# Altium schematic sheet 毕设.SchDoc
size A4
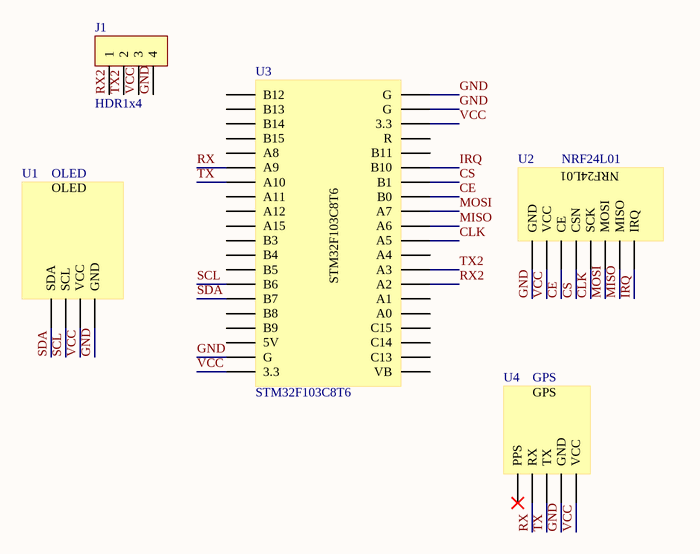
[diagram p0: 毕设.SchDoc]

## Parts
J1  HDR1x4  [PIN-4-2.54-1.0]
U1  OLED  [OLED]
U2  NRF24L01  [NRF24L01]
U3  STM32F103C8T6  [STM32F103C8T6]
U4  GPS  [GPS]

## Nets
CE: U2.3(CE) U3.13(B0)
CLK: U2.5(SCK) U3.10(A5)
CS: U2.4(CSN) U3.14(B1)
GND: J1.4 U1.4(GND) U2.1(GND) U3.19(G) U3.20(G) U3.22(G) U4.4(GND)
IRQ: U2.8(IRQ) U3.15(B10)
MISO: U2.7(MISO) U3.11(A6)
MOSI: U2.6(MOSI) U3.12(A7)
RX: U3.35(A9) U4.2(RX)
RX2: J1.1 U3.7(A2)
SCL: U1.2(SCL) U3.27(B6)
SDA: U1.1(SDA) U3.26(B7)
TX: U3.34(A10) U4.3(TX)
TX2: J1.2 U3.8(A3)
VCC: J1.3 U1.3(VCC) U2.2(VCC) U3.18(3.3) U3.21(3.3) U4.5(VCC)

Not connected (* = marked no-connect by the designer): U3 1(VB) 2(C13) 3(C14) 4(C15) 5(A0) 6(A1) 9(A4) 16(B11) 17(R) 23(5V) 24(B9) 25(B8) 28(B5) 29(B4) 30(B3) 31(A15) 32(A12) 33(A11) 36(A8) 37(B15) 38(B14) 39(B13) 40(B12); U4 1(PPS)*

## Library data of the parts
J1 = HDR1x4: Connector